# EAGLE design MAG (EAGLE 9.4.2)
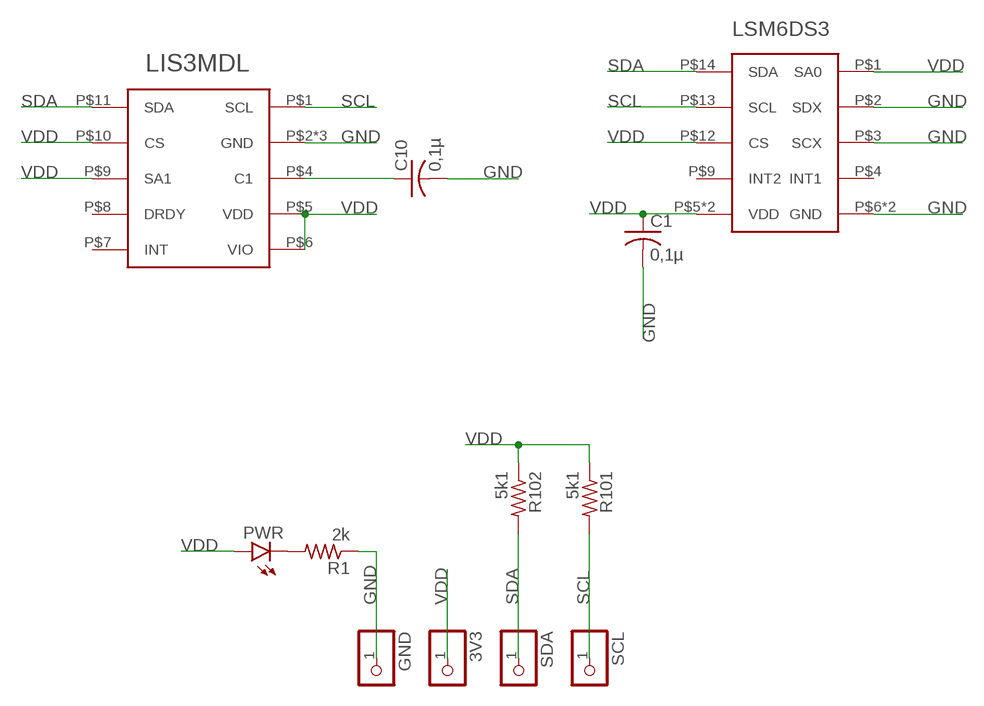
[diagram p0: schematic, sheet 1]

## Parts
3V3  PINHD-1X1  [1X01]
C1  0,1µ  C-USC0603  [C0603]
C10  0,1µ  C-USC0603  [C0603]
GND  PINHD-1X1  [1X01]
LIS3MDL  LIS3MDL  [LIS3MDL]
LSM6DS3  LSM6DS3  [LSM6DS3]
PWR  LEDCHIPLED_0603  [CHIPLED_0603]
R1  2k  R-US_R0603  [R0603]
R101  5k1  R-US_R0603  [R0603]
R102  5k1  R-US_R0603  [R0603]
SCL  PINHD-1X1  [1X01]
SDA  PINHD-1X1  [1X01]

## Nets
GND: C1.2 C10.2 GND.1 LIS3MDL.P$2(GND) LIS3MDL.P$3(GND) LIS3MDL.P$12(GND) LSM6DS3.P$2(SDX) LSM6DS3.P$3(SCX) LSM6DS3.P$6(GND) LSM6DS3.P$7(GND) R1.1
N$1: PWR.C R1.2
N$3: C10.1 LIS3MDL.P$4(C1)
SCL: LIS3MDL.P$1(SCL) LSM6DS3.P$13(SCL) R101.2 SCL.1
SDA: LIS3MDL.P$11(SDA) LSM6DS3.P$14(SDA) R102.2 SDA.1
VDD: 3V3.1 C1.1 LIS3MDL.P$5(VDD) LIS3MDL.P$6(VIO) LIS3MDL.P$9(SA1) LIS3MDL.P$10(CS) LSM6DS3.P$1(SA0) LSM6DS3.P$5(VDD) LSM6DS3.P$8(VDD) LSM6DS3.P$12(CS) PWR.A R101.1 R102.1
Unconnected: LIS3MDL.P$7(INT) LIS3MDL.P$8(DRDY) LSM6DS3.P$4(INT1) LSM6DS3.P$9(INT2)

## Library data of the parts
3V3 GND SCL SDA = pinheadCS:PINHD-1X1: PIN HEADER
C1 C10 = rcl:C-US: CAPACITOR, American symbol; SPICEPREFIX: C
LIS3MDL = CanCubeSat:LIS3MDL
LSM6DS3 = CanCubeSat:LSM6DS3
PWR = led:LED: LED OSRAM: - CHIPLED LG R971, LG N971, LY N971, LG Q971, LY Q971, LO R971, LY R971 LH N974, LH R974 LS Q976, LO Q976, LY Q976 LO Q996 - Hyper CHIPLED LW Q18S LB Q993, LB Q99A, LB R99A - SideLED LS A670, LO A670, LY A670, LG A670, LP A670 LB A673, LV A673, LT A673, LW A673 LH A674 LY A675 LS A676, LA A676, LO A676, LY A676, LW A676 LS A679, LY A679, LG A679 - Hyper Micro SIDELED® LS Y876, LA Y876, LO Y876, LY Y876 LT Y87S - SmartLED LW L88C, LW L88S LB L89C, LB L89S, LG L890 LS L89K, LO L89K, LY L89K LS L896, LA L896, LO L896, LY L896 - TOPLED LS T670, LO T670, LY T670, LG T670, LP T670 LSG T670, LSP T670, LSY T670, LOP T670, LYG T670 LG T671, LOG T671, LSG T671 LB T673, LV T673, LT T673, LW T673 LH T674 LS T676, LA T676, LO T676, LY T676, LB T676, LH T676, LSB T676, LW T676 LB T67C, LV T67C, LT T67C, LS T67K, LO T67K, LY T67K, LW E67C LS E67B, LA E67B, LO E67B, LY E67B, LB E67C, LV E67C, LT E67C LW T67C LS T679, LY T679, LG T679 LS T770, LO T770, LY T770, LG T770, LP T770 LB T773, LV T773, LT T773, LW T773 LH T774 LS E675, LA E675, LY E675, LS T675 LS T776, LA T776, LO T776, LY T776, LB T776 LHGB T686 LT T68C, LB T68C - Hyper Mini TOPLED® LB M676 - Mini TOPLED Santana® LG M470 LS M47K, LO M47K, LY M47K Source: http://www.osram.convergy.de LUXEON: - LUMILED® LXK2-PW12-R00, LXK2-PW12-S00, LXK2-PW14-U00, LXK2-PW14-V00 LXK2-PM12-R00, LXK2-PM12-S00, LXK2-PM14-U00 LXK2-PE12-Q00, LXK2-PE12-R00, LXK2-PE12-S00, LXK2-PE14-T00, LXK2-PE14-U00 LXK2-PB12-K00, LXK2-PB12-L00, LXK2-PB12-M00, LXK2-PB14-N00, LXK2-PB14-P00, LXK2-PB14-Q00 LXK2-PR12-L00, LXK2-PR12-M00, LXK2-PR14-Q00, LXK2-PR14-R00 LXK2-PD12-Q00, LXK2-PD12-R00, LXK2-PD12-S00 LXK2-PH12-R00, LXK2-PH12-S00 LXK2-PL12-P00, LXK2-PL12-Q00, LXK2-PL12-R00 Source: www.luxeon.com KINGBRIGHT: KA-3528ASYC Source: www.kingbright.com
R1 R101 R102 = resistor:R-US_: RESISTOR, American symbol

## Board
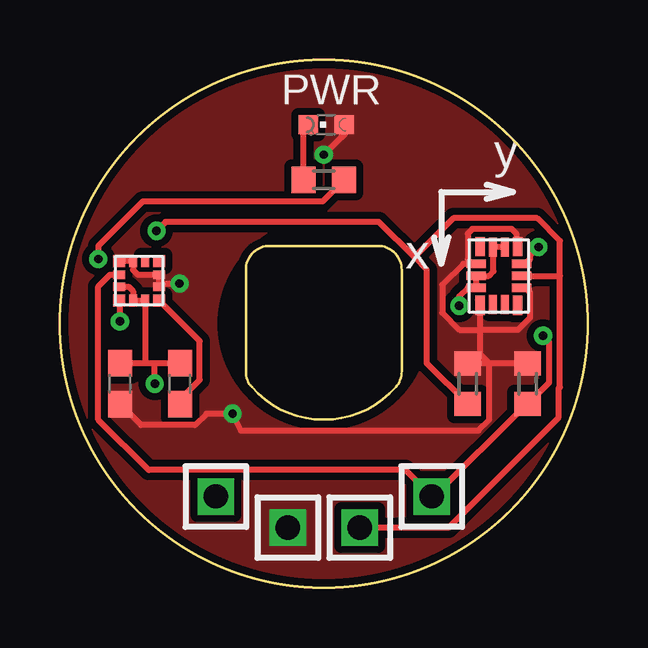
[diagram p1: board, top side]
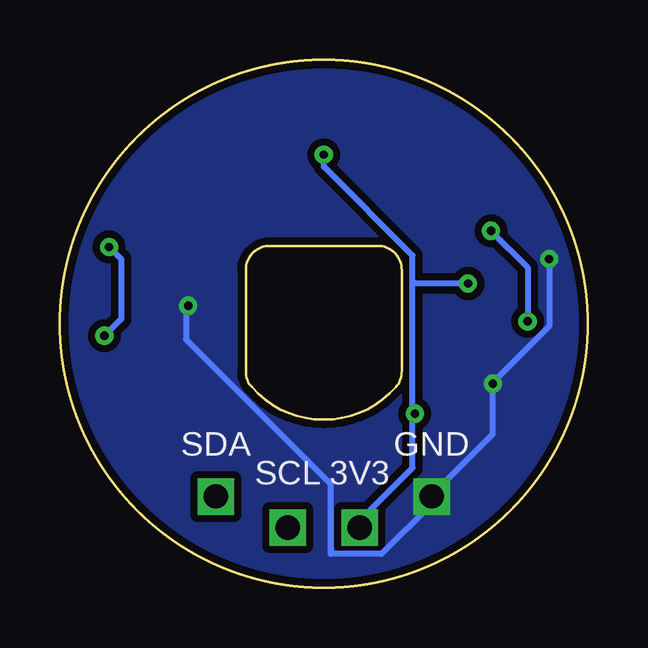
[diagram p2: board, bottom side, seen from below]

Size 22 x 22 mm. Coordinates in mm from the lower left corner, seen from the top.
Outline: 7.75,9.02 7.75,13.25 arc-90 8.75,14.25 13.25,14.25 arc-90 14.25,13.25 14.25,9.02 arc-41 14,8.35 arc-97 8,8.35 arc-41 7.75,9.02
Outline: circle at 11,11 radius 11
Copper layers (1*16): Top 0.035mm / dielectric 1.5mm / Bottom 0.035mm
Design rules "default *": minimum track width 0.25mm, minimum drill 0.35mm, track to track 0.2mm, track to pad 0.2mm, pad to pad 0.15mm, via to via 0.2mm, smd to smd 0.2mm, copper to edge 0.25mm, drill to drill 0.1mm, minimum pad ring 10mil, minimum via ring 8mil, stop-mask expansion 1mil, vias tented up to drill 0mil, thermal gap 10mil
tRestrict: area 7,7 to 15,15

### Footprints (pad centres in the part's own frame; a part is rotated, then mirrored left to right if it is on the bottom)
1X01 = drill 1.016 square: 1 0,0
C0603 = smd 1.1 x 1: 1 -0.85,0; 2 0.85,0
LIS3MDL = smd 0.5 x 0.5: P$1 -0.825,0.825; P$4 -0.825,-0.825; P$7 0.825,-0.825; P$10 0.825,0.825 | smd 0.5 x 0.35: P$2 -0.825,0.25; P$3 -0.825,-0.25; P$8 0.825,-0.25; P$9 0.825,0.25 | smd 0.35 x 0.5: P$5 -0.25,-0.825; P$6 0.25,-0.825; P$11 0.25,0.825; P$12 -0.25,0.825
LSM6DS3 = smd 0.8 x 0.4: P$1 -1.225,0.775; P$4 -1.225,-0.775; P$8 1.225,-0.775; P$11 1.225,0.775 | smd 0.8 x 0.35: P$2 -1.2,0.25; P$3 -1.2,-0.25; P$9 1.2,-0.25; P$10 1.2,0.25 | smd 0.35 x 0.8: P$5 -0.5,-0.95; P$6 0,-0.95; P$7 0.5,-0.95; P$12 0.5,0.95; P$13 0,0.95; P$14 -0.5,0.95
CHIPLED_0603 = smd 0.8 x 0.8: A 0,-0.75; C 0,0.75
R0603 = smd 1 x 1.1: 1 -0.85,0; 2 0.85,0

### Placement (x,y rotation side)
3V3  9.5,2.5 0 top
C1  2.5,8.5 90 top
C10  5,8.5 90 top
GND  6.5,3.8 0 top
LIS3MDL  3.3,12.8 90 top
LSM6DS3  18.3,13 270 top
PWR  11.1,19.3 90 top
R1  11,17 180 top
R101  17,8.5 270 top
R102  19.5,8.5 270 top
SCL  12.5,2.5 0 top
SDA  15.5,3.8 0 top

### Tracks (layer width: path | path; a pad name or v marks a point on that pad's centre or on a via)
GND  (via drill 0.35)
  Top 0.25: R1.1 10.95,16.1 3.45,16.1 1.6,14.25 v1.6,13.7 | C10.2 3.95,9.35 | 3.95,9.35 3.5,9.35 | 3.5,9.35 C1.2 | LSM6DS3.P$2 LSM6DS3.P$3 18.05,13.84 18.07,13.81 18.07,13.19 17.89,13 LSM6DS3.P$6 LSM6DS3.P$7 17,12.5 16.65,12.15 v16.65,11.75 | v3.95,8.5 3.95,9.35 | LIS3MDL.P$12 2.86,12.55 3.05,12.36 LIS3MDL.P$2 LIS3MDL.P$3 3.55,9.4 3.5,9.35
  Bottom 0.25: v16.65,11.75 16.75,11.65 16.75,10.35 10.7,4.3 10.7,1.4 8.6,1.4 6.5,3.5 GND.1 6.45,3.9 3.95,6.4 v3.95,8.5 3.9,8.6 1.6,10.9 v1.6,13.7
  pour Bottom (isolate 0.3, no thermals): 0,0 0,22 22,22 22,0
N$1
  Top 0.25: R1.2 10.15,19.1 PWR.C
N$3
  Top 0.25: C10.1 5,7.84 5.83,8.66 5.83,10.28 LIS3MDL.P$4
SCL  (via drill 0.35)
  Top 0.25: 14.78,13.78 15.3,13.25 15.3,9.35 R101.2 | 14.78,13.78 13.3,15.25 4.4,15.25 v4.03,14.88 | 14.78,13.78 16.4,15.4 19.9,15.4 20.85,14.45 20.85,13 | SCL.1 16.2,2.5 20.8,7.1 20.8,8.31 20.85,8.36 20.85,13 | v2.5,11.1 2.5,11.95 LIS3MDL.P$1 | LSM6DS3.P$13 20.85,13
  Bottom 0.25: v4.03,14.88 2.5,13.35 v2.5,11.1
SDA  (via drill 0.35)
  Top 0.25: LIS3MDL.P$11 2.09,13.05 1.6,12.56 1.6,7 3.7,4.9 14.4,4.9 SDA.1 15.6,3.8 19.4,7.6 R102.2 20.4,8.55 20.4,10.25 v20.15,10.5 | v19.95,14.2 19.6,13.85 19.6,13.69 19.41,13.5 LSM6DS3.P$14
  Bottom 0.25: v20.15,10.5 19.45,11.2 19.45,13.69 v19.95,14.2
VDD  (via drill 0.35)
  Top 0.25: R102.1 17.9,9.35 | 17.9,9.35 R101.1 | v11,18.05 11.75,18.8 | 17.9,9.35 17.9,7 17.45,6.55 7.55,6.55 v7.2,7.25 6.11,7.25 5.63,6.78 3.38,6.78 C1.1 | LIS3MDL.P$10 LIS3MDL.P$9 3.05,13.24 3.24,13.05 LIS3MDL.P$6 LIS3MDL.P$5 4.25,12.68 v4.99,12.68 | 17.9,9.35 17.52,9.72 17.52,10.75 16.66,10.75 15.95,11.46 15.95,12.63 16.82,13.5 LSM6DS3.P$5 17.19,13.5 17,13.69 17,14.76 17.19,14.95 18.84,14.95 19.05,14.73 19.05,14.25 LSM6DS3.P$1 | LSM6DS3.P$8 17.52,10.74 19.1,10.74 19.6,11.24 19.6,12.31 19.41,12.5 LSM6DS3.P$12
  Top 0.3: 11.75,18.8 11.85,18.9 PWR.A
  Bottom 0.25: v11,18.05 11,17.55 7.3,13.85 7.3,12.7 | 7.3,7.25 7.3,5 9.5,2.8 3V3.1 | 7.3,7.25 7.3,12.7 | v7.2,7.25 7.3,7.25 | v4.99,12.68 7.28,12.68 7.3,12.7
  pour Top (isolate 0.3, no thermals): 0,0 0,22 22,22 22,0

### Text on the board
tNames: y | x